# EAGLE schematic scheme (EAGLE 9.6.2)
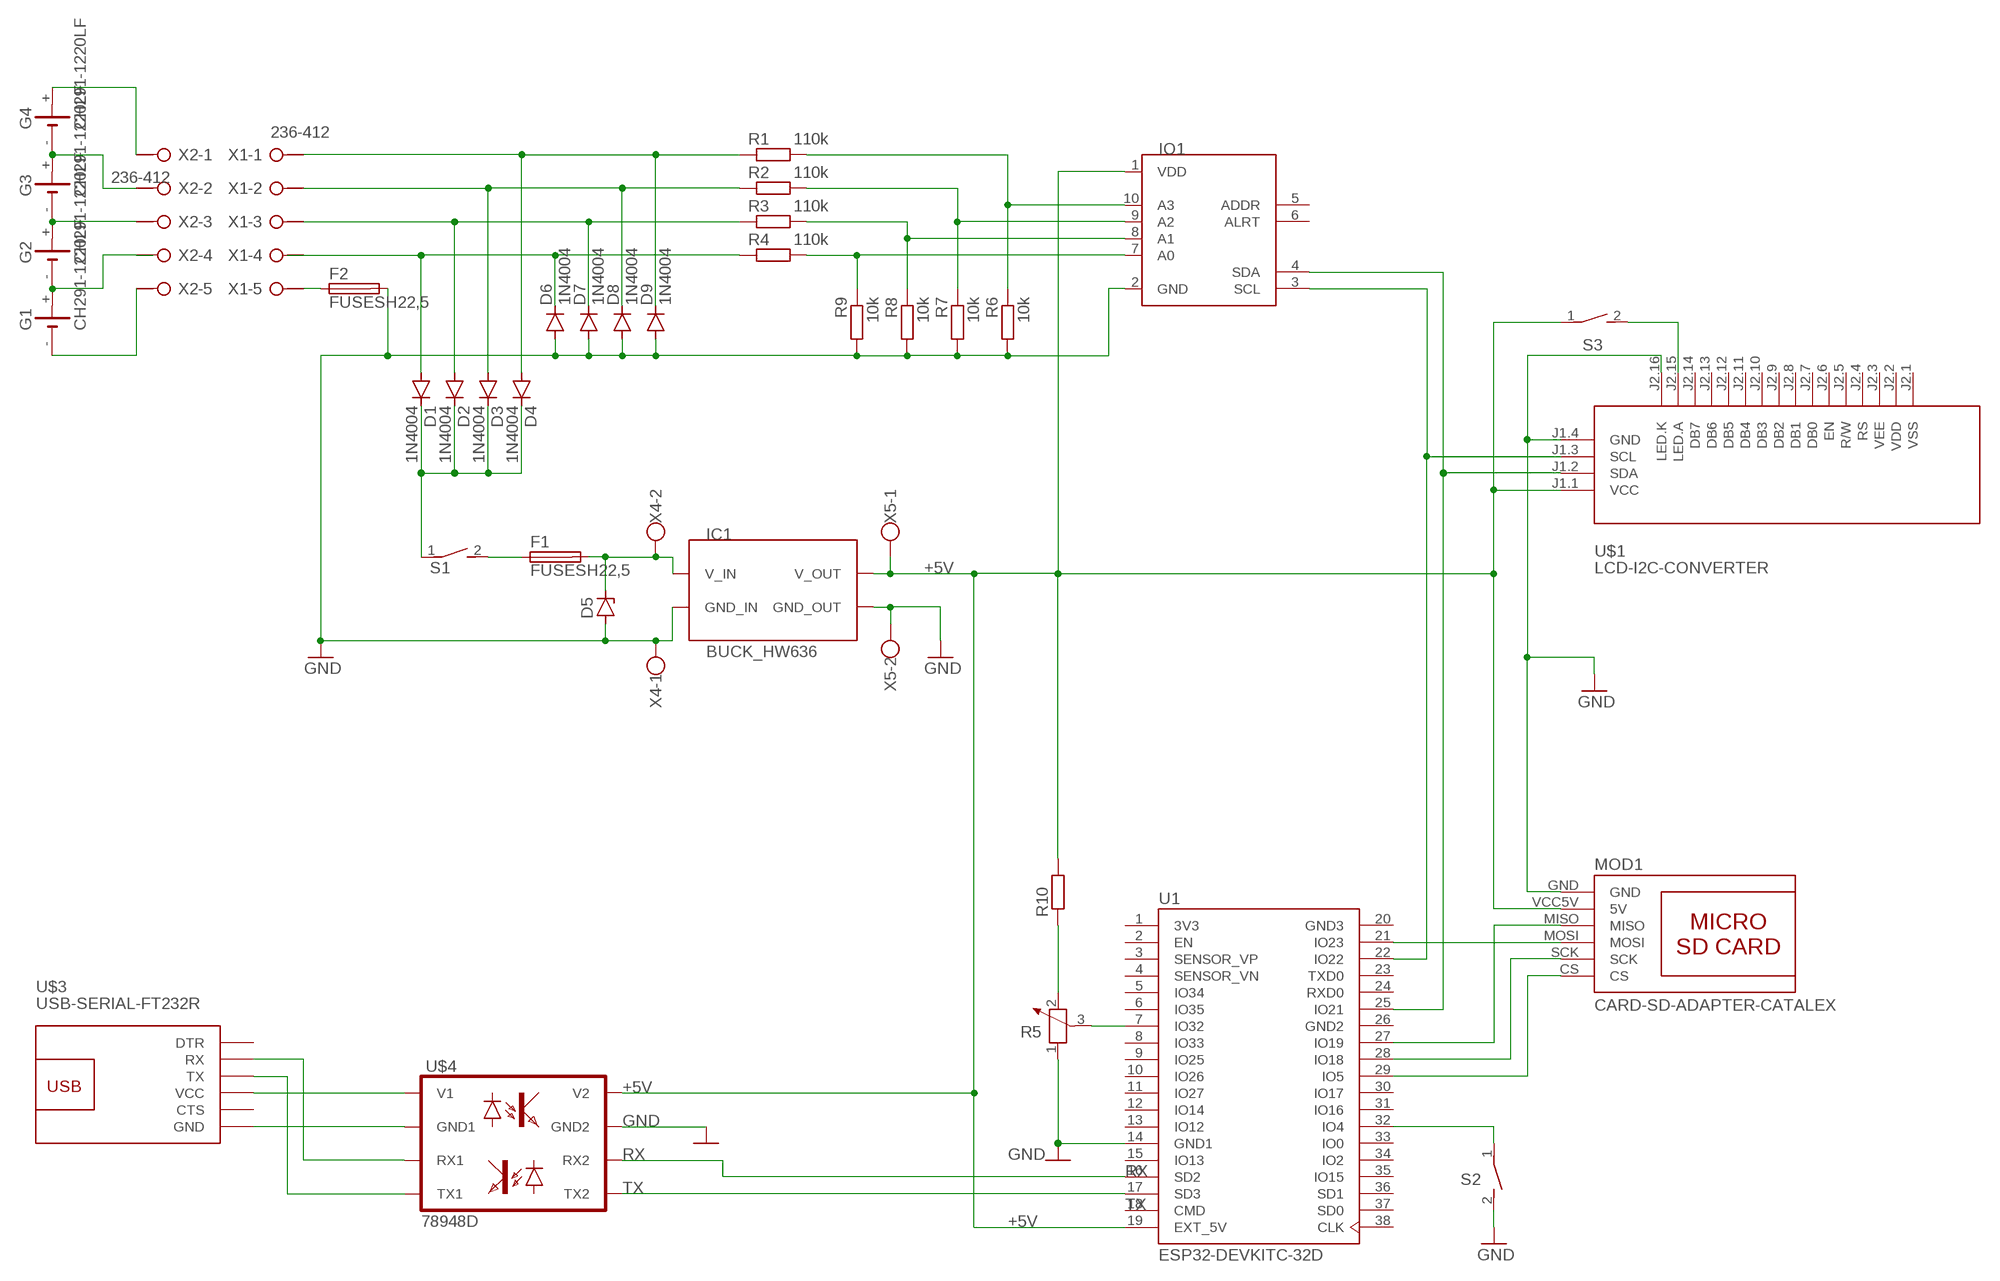
[diagram p0: schematic, sheet 1]

## Parts
D1  1N4004  [DO41-10]
D2  1N4004  [DO41-10]
D3  1N4004  [DO41-10]
D4  1N4004  [DO41-10]
D5  ZENER-DIODEDO41Z10  [DO41Z10]
D6  1N4004  [DO41-10]
D7  1N4004  [DO41-10]
D8  1N4004  [DO41-10]
D9  1N4004  [DO41-10]
F1  FUSESH22,5  [SH22,5]
F2  FUSESH22,5  [SH22,5]
G1  CH291-1220LF  [CH291-1220LF]
G2  CH291-1220LF  [CH291-1220LF]
G3  CH291-1220LF  [CH291-1220LF]
G4  CH291-1220LF  [CH291-1220LF]
IC1  BUCK_HW636  (no package)
IO1  ADC_ADS1115  [10PIN]
MOD1  CARD-SD-ADAPTER-CATALEX  [CARD-SD-ADAPTER-CATALEX]
R1  110k  R-EU_0204/7  [0204/7]
R2  110k  R-EU_0204/7  [0204/7]
R3  110k  R-EU_0204/7  [0204/7]
R4  110k  R-EU_0204/7  [0204/7]
R5  POTENTIOMETER_PT-10  [PT-10]
R6  10k  R-EU_0204/7  [0204/7]
R7  10k  R-EU_0204/7  [0204/7]
R8  10k  R-EU_0204/7  [0204/7]
R9  10k  R-EU_0204/7  [0204/7]
R10  R-EU_0207/10  [0207/10]
S1  DS01E  [DS-01]
S2  DS01E  [DS-01]
S3  DS01E  [DS-01]
U1  ESP32-DEVKITC-32D  [MODULE_ESP32-DEVKITC-32D]
U$1  LCD-I2C-CONVERTER  [LCD-I2C-CONVERTER]
U$3  USB-SERIAL-FT232R  [USB-SERIAL-FT232R]
U$4  78948D  (no package)
X1  236-412  [236-412]
X2  236-412  [236-412]
X4  W237-102  [W237-102]
X5  W237-102  [W237-102]

## Nets
+5V: IC1.V_OUT IO1.1(VDD) MOD1.VCC5V(5V) R10.2 S3.1 U1.19(EXT_5V) U$1.J1.1(VCC) U$4.V2 X5.1
GND: D5.A D6.A D7.A D8.A D9.A F2.2 IC1.GND_IN IC1.GND_OUT IO1.2(GND) MOD1.GND R5.1 R6.2 R7.2 R8.2 R9.2 S2.2 U1.14(GND1) U$1.J1.4(GND) U$1.J2.16(LED.K) U$4.GND2 X4.1 X5.2
N$1: MOD1.MOSI U1.21(IO23)
N$2: IO1.7(A0) R4.2 R9.1
N$3: MOD1.MISO U1.27(IO19)
N$4: MOD1.SCK U1.28(IO18)
N$5: MOD1.CS U1.29(IO5)
N$6: IO1.8(A1) R3.2 R8.1
N$7: IO1.9(A2) R2.2 R7.1
N$8: IO1.10(A3) R1.2 R6.1
N$9: R5.3 U1.7(IO32)
N$10: D1.C D2.C D3.C D4.C S1.1
N$11: F1.1 S1.2
N$12: D5.C F1.2 IC1.V_IN X4.2
N$13: G1.+ G2.- X2.4@1(-4:KL1) X2.4@2(-4:KL2)
N$14: D4.A D9.C R1.1 X1.1@1(-1:KL1)
N$15: G3.+ G4.- X2.2@1(-2:KL1)
N$16: G4.+ X2.1@1(-1:KL1)
N$17: D3.A D8.C R2.1 X1.2@1(-2:KL1)
N$18: F2.1 X1.5@1(-5:KL1)
N$19: D2.A D7.C R3.1 X1.3@1(-3:KL1)
N$20: D1.A D6.C R4.1 X1.4@1(-4:KL1) X1.4@2(-4:KL2)
N$21: G1.- X2.5@1(-5:KL1)
N$22: S2.1 U1.32(IO4)
N$23: G2.+ G3.- X2.3@1(-3:KL1)
N$24: S3.2 U$1.J2.15(LED.A)
N$25: U$3.4(VCC) U$4.V1
N$26: U$3.6(GND) U$4.GND1
N$27: U$3.3(TX) U$4.TX1
N$28: U$3.2(RX) U$4.RX1
N$29: R5.2 R10.1
RX: U1.16(SD2) U$4.RX2
SCL: IO1.3(SCL) U1.22(IO22) U$1.J1.3(SCL)
SDA: IO1.4(SDA) U1.25(IO21) U$1.J1.2(SDA)
TX: U1.17(SD3) U$4.TX2
Unconnected: IO1.5(ADDR) IO1.6(ALRT) U1.2(EN) U1.3(SENSOR_VP) U1.4(SENSOR_VN) U1.5(IO34) U1.6(IO35) U1.8(IO33) U1.9(IO25) U1.10(IO26) U1.11(IO27) U1.12(IO14) U1.13(IO12) U1.15(IO13) U1.18(CMD) U1.23(TXD0) U1.24(RXD0) U1.30(IO17) U1.31(IO16) U1.33(IO0) U1.34(IO2) U1.35(IO15) U1.36(SD1) U1.37(SD0) U1.38(CLK) U$1.J2.1(VSS) U$1.J2.2(VDD) U$1.J2.3(VEE) U$1.J2.4(RS) U$1.J2.5(R/W) U$1.J2.6(EN) U$1.J2.7(DB0) U$1.J2.8(DB1) U$1.J2.9(DB2) U$1.J2.10(DB3) U$1.J2.11(DB4) U$1.J2.12(DB5) U$1.J2.13(DB6) U$1.J2.14(DB7) U$3.1(DTR) U$3.5(CTS) X1.1@2(-1:KL2) X1.2@2(-2:KL2) X1.3@2(-3:KL2) X1.5@2(-5:KL2) X1.6@1(-6:KL1) X1.6@2(-6:KL2) X1.7@1(-7:KL1) X1.7@2(-7:KL2) X1.8@1(-8:KL1) X1.8@2(-8:KL2) X1.9@1(-9:KL1) X1.9@2(-9:KL2) X1.10@1(-10:KL1) X1.10@2(-10:KL2) X1.11@1(-11:KL1) X1.11@2(-11:KL2) X1.12@1(-12:KL1) X1.12@2(-12:KL2) X2.1@2(-1:KL2) X2.2@2(-2:KL2) X2.3@2(-3:KL2) X2.5@2(-5:KL2) X2.6@1(-6:KL1) X2.6@2(-6:KL2) X2.7@1(-7:KL1) X2.7@2(-7:KL2) X2.8@1(-8:KL1) X2.8@2(-8:KL2) X2.9@1(-9:KL1) X2.9@2(-9:KL2) X2.10@1(-10:KL1) X2.10@2(-10:KL2) X2.11@1(-11:KL1) X2.11@2(-11:KL2) X2.12@1(-12:KL1) X2.12@2(-12:KL2)

## Power pins joined to a net without a drawn wire
3V3: U1.1(3V3)
GND2: U1.26(GND2)
GND3: U1.20(GND3)

## Library data of the parts
D1-D4 D6-D9 = diode:1N4004: DIODE general purpose rectifier, 1 A
D5 = diode:ZENER-DIODE: Z-Diode
F1 F2 = fuse:FUSE: Fuse; OC_FARNELL: unknown; OC_NEWARK: unknown
G1-G4 = battery:CH291-1220LF: Battery Holder, SMT, 12mm multicomp PART NO. CH291-1220LF Source: Data sheet <http://www.farnell.com/datasheets/1505860.pdf>
IC1 = fslib:BUCK_HW636
IO1 = fslib:ADC_ADS1115
MOD1 = SD-Card-Module_CATALEX:CARD-SD-ADAPTER-CATALEX: Micro SD Card Adapter Module with onboard 3.3V regulator
R1-R4 R6-R10 = rcl:R-EU_: RESISTOR, European symbol; SPICEPREFIX: R
R5 = rcl:POTENTIOMETER_: Potentiometer; SPICEMODEL: POT; SPICEPREFIX: X
S1-S3 = switch-dil:DS01E: DIL/CODE SWITCH; OC_FARNELL: unknown; OC_NEWARK: unknown
U1 = ESP32-DEVKITC-32D:ESP32-DEVKITC-32D: Eval Board For Esp-Wroom-32 Check prices <https://pricing.snapeda.com/parts/ESP32-DEVKITC-32D/Espressif%20Systems/view-part?ref=eda>; AVAILABILITY: In Stock; DESCRIPTION: WiFi Development Tools (802.11) ESP32 General Development Kit, ESP32-WROOM-32D on the board; MF: Espressif Systems; MP: ESP32-DEVKITC-32D; PACKAGE: None; PRICE: None; PURCHASE-URL: https://pricing.snapeda.com/search/part/ESP32-DEVKITC-32D/?ref=eda
U$1 = i2c_lcd_convertor:LCD-I2C-CONVERTER: I2C Bus to 4-Bit Parallel LCD Interface with LED backlight driver
U$3 = USB-SERIAL-CP2102:USB-SERIAL-FT232R: USB to Serial UART Converter based on FT232R chip More information about FT232R chip is available here: http://www.ftdichip.com/Products/ICs/FT232R.htm Click here to find device on ebay.com <http://www.ebay.com/sch/ft232rl+arduino+download+max232>
U$4 = opto_RXTX_isolator:78948D
X1 X2 = con-wago-508:236-412: Terminal Strips 2.5 mm2/AWG 12, Series 236, Pin Spacings 5/5.08 mm Source: Data sheet <http://www.farnell.com/datasheets/63479.pdf>; MF: Wago Corporation; MPN: 0236-0412; OC_FARNELL: 1283531; OC_NEWARK: 79K2064
X4 X5 = con-wago-500:W237-102: WAGO SCREW CLAMP; MPN: 237-102; OC_FARNELL: unknown; OC_NEWARK: 70K9898